# EAGLE design TribeBot21 (EAGLE 6.6.0)
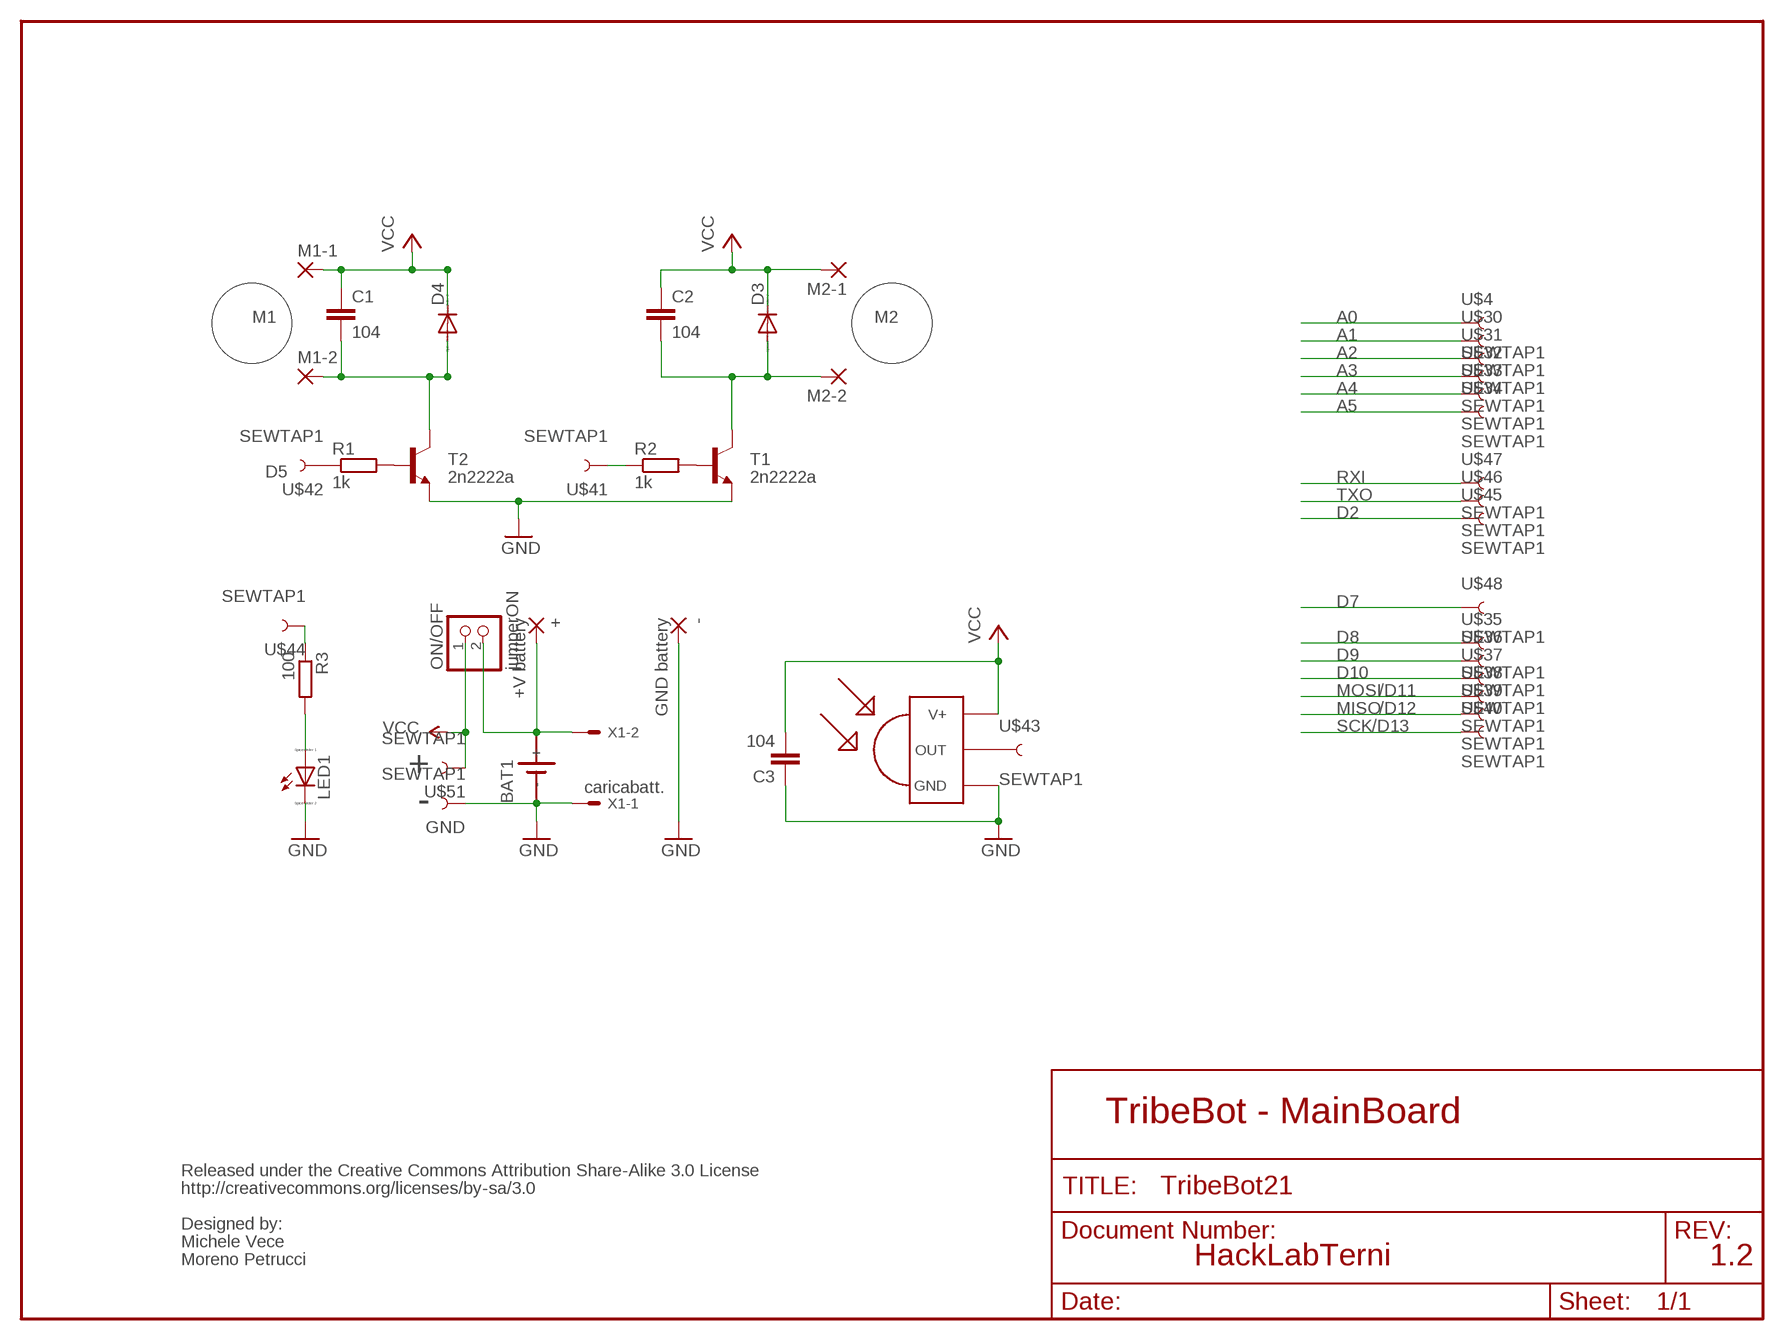
[diagram p0: schematic, sheet 1]

## Parts
+  +V battery  2,15/1,0  [2,15/1,0]
-  GND battery  2,15/1,0  [2,15/1,0]
BAT1  SN2032  [SN2032]
C1  104  C2.5/2  [C2.5-2]
C2  104  C2.5/2  [C2.5-2]
C3  104  C2.5/2  [C2.5-2]
D3  1N4148DO35-7  [DO35-7]
D4  1N4148DO35-7  [DO35-7]
GND  SEWTAP1  [PETAL-LONG-1]
LED1  LED_ELD260  [LED_LD260]
M1-1  1,6/0,8  [1,6/0,8]
M1-2  1,6/0,8  [1,6/0,8]
M2-1  1,6/0,8  [1,6/0,8]
M2-2  1,6/0,8  [1,6/0,8]
ON/OFF  jumperON  PINHD-1X2  [1X02]
R1  1k  R-EU_0204/7  [0204/7]
R2  1k  R-EU_0204/7  [0204/7]
R3  100  R-EU_0204/7  [0204/7]
T1  2n2222a  TRANSISTOR_NPNTO92  [TO-92]
T2  2n2222a  TRANSISTOR_NPNTO92  [TO-92]
U$1  TSOP4838  [TSOP18XX]
U$4  SEWTAP1  [PETAL-LONG-1]
U$30  SEWTAP1  [PETAL-LONG-1]
U$31  SEWTAP1  [PETAL-LONG-1]
U$32  SEWTAP1  [PETAL-LONG-1]
U$33  SEWTAP1  [PETAL-LONG-1]
U$34  SEWTAP1  [PETAL-LONG-1]
U$35  SEWTAP1  [PETAL-LONG-1]
U$36  SEWTAP1  [PETAL-LONG-1]
U$37  SEWTAP1  [PETAL-LONG-1]
U$38  SEWTAP1  [PETAL-LONG-1]
U$39  SEWTAP1  [PETAL-LONG-1]
U$40  SEWTAP1  [PETAL-LONG-1]
U$41  SEWTAP1  [PETAL-LONG-1]
U$42  SEWTAP1  [PETAL-LONG-1]
U$43  SEWTAP1  [PETAL-LONG-1]
U$44  SEWTAP1  [PETAL-LONG-1]
U$45  SEWTAP1  [PETAL-LONG-1]
U$46  SEWTAP1  [PETAL-LONG-1]
U$47  SEWTAP1  [PETAL-LONG-1]
U$48  SEWTAP1  [PETAL-LONG-1]
U$51  SEWTAP1  [PETAL-LONG-1]
X1  caricabatt.  22-23-2021  [22-23-2021]

## Nets
A0: U$4.1
A1: U$30.1
A2: U$31.1
A3: U$32.1
A4: U$33.1
A5: U$34.1
D2: U$45.1
D7: U$48.1
D8: U$35.1
D9: U$36.1
D10: U$37.1
GND [VCC]: -.1(P) BAT1.- C3.1 GND.1 LED1.K(C) T1.1(E) T2.1(E) U$1.GND X1.1
MISO: U$39.1
MOSI: U$38.1
N$1: R1.2 T2.2(B)
N$2: R2.2 T1.2(B)
N$3: R1.1 U$42.1
N$4: R2.1 U$41.1
N$5: LED1.A R3.2
N$6: +.1(P) BAT1.+ ON/OFF.2 X1.2
N$7: U$1.OUT U$43.1
N$8: C1.2 D4.A M1-2.1(P) T2.3(C)
N$9: R3.1 U$44.1
N$12: C2.2 D3.A M2-2.1(P) T1.3(C)
RXI: U$47.1
SCK: U$40.1
TXO: U$46.1
VCC [VCC]: C1.1 C2.1 C3.2 D3.C D4.C M1-1.1(P) M2-1.1(P) ON/OFF.1 U$1.VCC(V+) U$51.1

## Notes on the sheet
- M1 | M2
- D5
- /D11
- /D12
- /D13
- +
- -
- TribeBot - MainBoard
- Released under the Creative Commons Attribution Share-Alike 3.0 License
- http://creativecommons.org/licenses/by-sa/3.0
- Designed by:
- Michele Vece
- Moreno Petrucci | HackLabTerni | 1.2

## Library data of the parts
+ - = wirepad:2,15/1,0: THROUGH-HOLE PAD
BAT1 = sn2032:SN2032: LI BATTERY
C1-C3 = capacitor-wima:C: CAPACITOR naming: grid - package width
D3 D4 = diode:1N4148: DIODE high speed (Philips)
GND U$4 U$30-U$48 U$51 = LilyPad-Wearables:SEWTAP: Sew Taps for LilyPad Boards.
LED1 = eagle-ltspice:LED_E: LED Source: http://www.osram.convergy.de Source: www.luxeon.com Source: www.kingbright.com; SPICEMODEL: NONE; SPICEPREFIX: D; SPICETYPE: diode
M1-1 M1-2 M2-1 M2-2 = wirepad:1,6/0,8: THROUGH-HOLE PAD
ON/OFF = pinhead:PINHD-1X2: PIN HEADER
R1-R3 = resistor:R-EU_: RESISTOR, European symbol
T1 T2 = SparkFun-DiscreteSemi:TRANSISTOR_NPN: Generic NPN BJT MMBT2222A - TRANS-08049 (SOT-23, 1A 40V) MPSA42 - TRANS-09116 (SOT-23, 500mA 300V) MMBT5088LT1G - TRANS-11160 (SOT-23, 50 mA 30V) BC547 - COM-08928 <http://www.sparkfun.com/products/8928> (TO-92 45V 100mA) (1.Collector 2.Base 3.Emitter) 2N3904 - COM-00521 <http://www.sparkfun.com/products/521> (TO-92 40V 200mA) (1.Emitter 2.Base 3.Collector) P2N2222A - COM-12852 <http://www.sparkfun.com/products/12852> (TO-92 40V 600mA) (1.Collector 2.Base 3.Emitter)
U$1 = tsop:TSOP4838: IR Receiver and Demodulator
X1 = con-molex:22-23-2021: .100" (2.54mm) Center Header - 2 Pin; MF: MOLEX; MPN: 22-23-2021; OC_FARNELL: 1462926; OC_NEWARK: 25C3832

## Net classes
1 VCC: width 0.305 mm

## Board
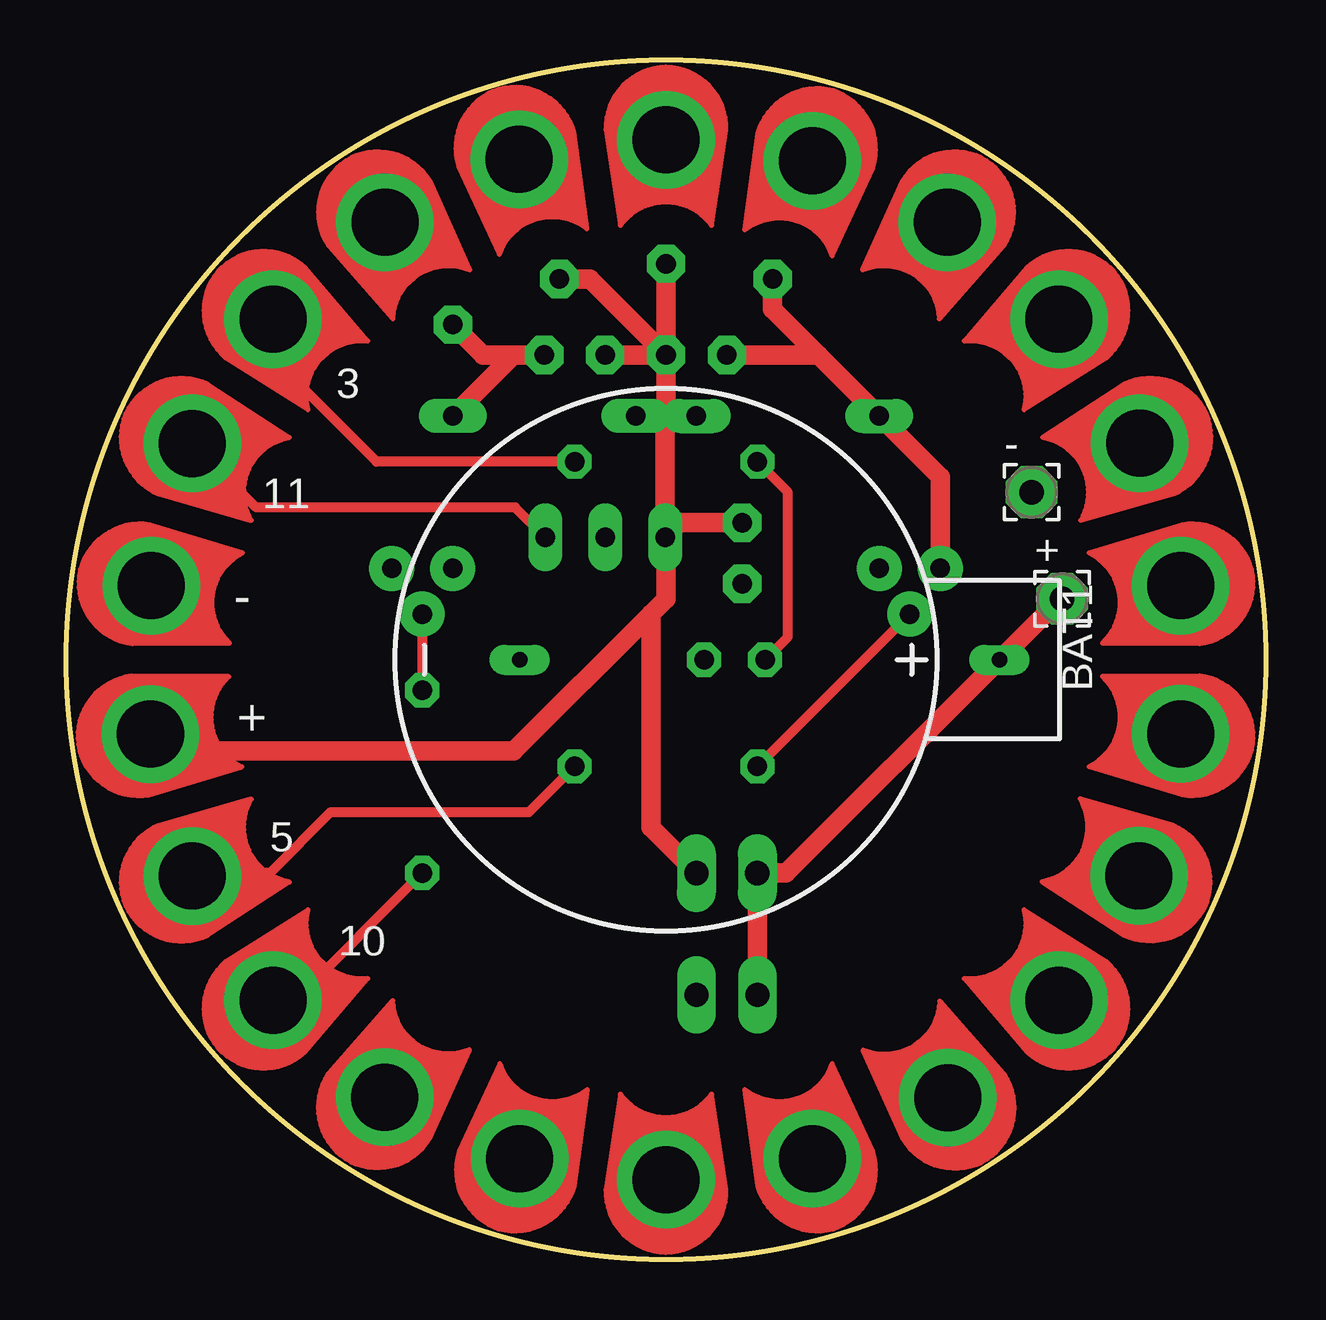
[diagram p1: board, top side]
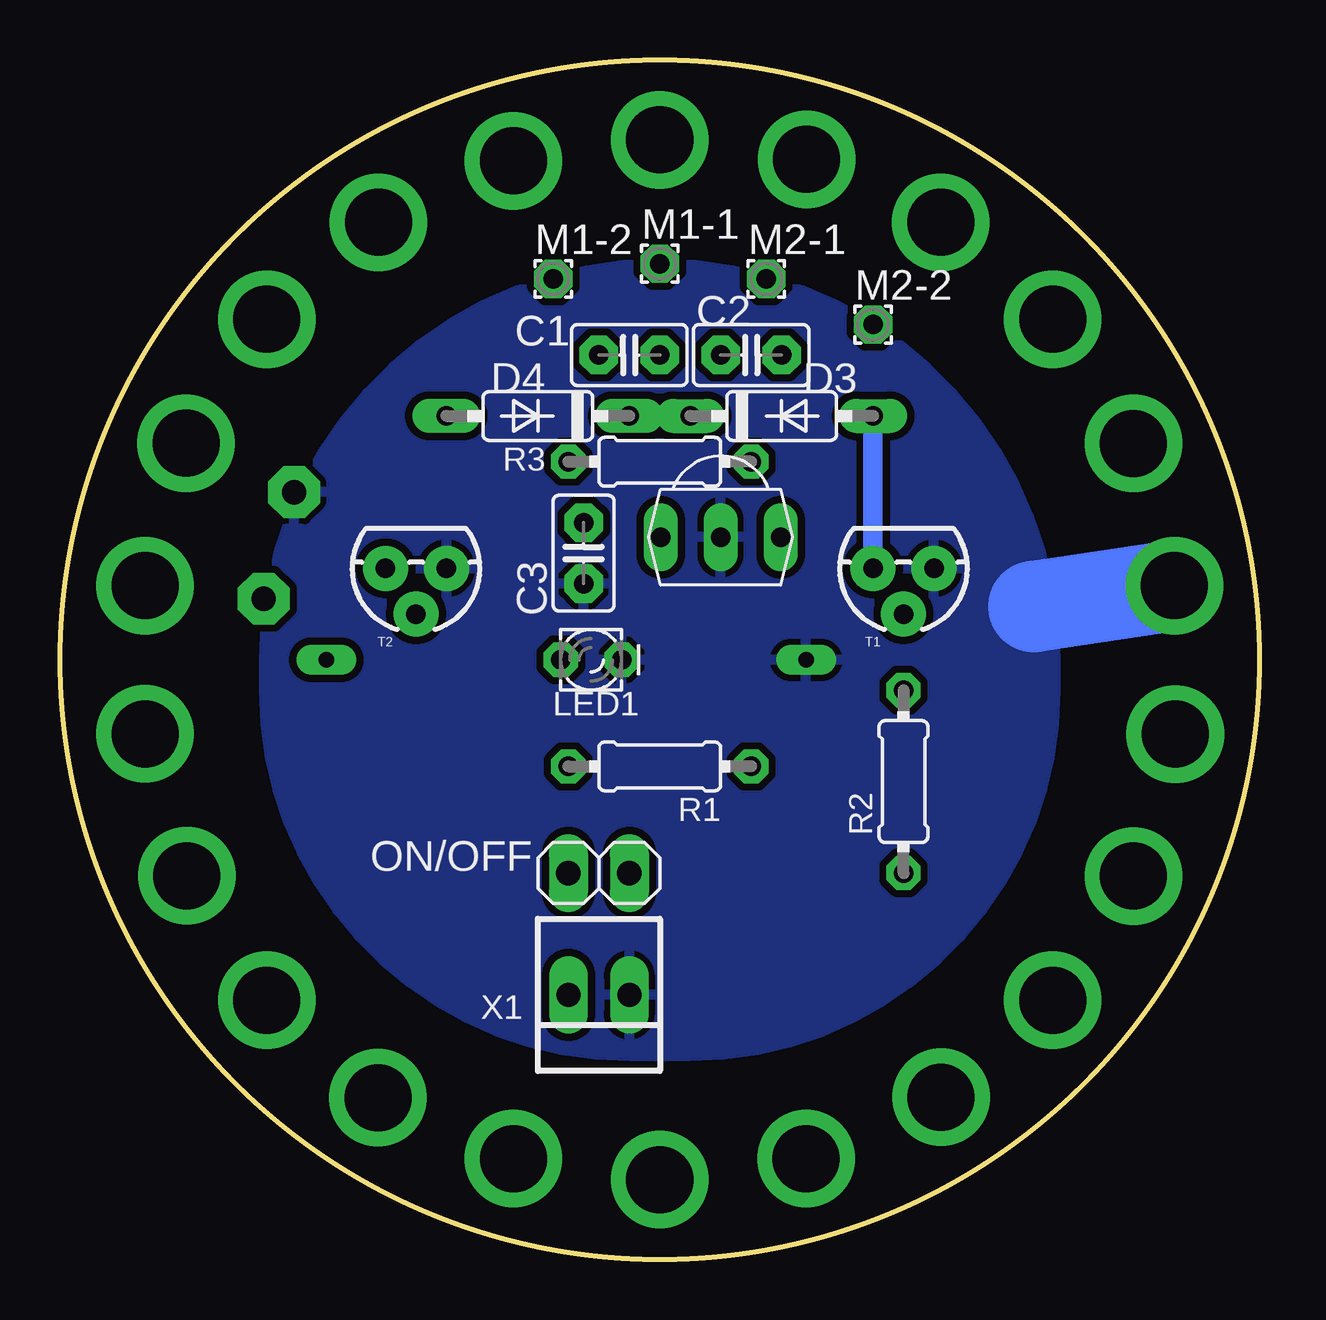
[diagram p2: board, bottom side, seen from below]

Size 50 x 50 mm. Coordinates in mm from the lower left corner, seen from the top.
Outline: circle at 25,25 radius 25
Copper layers (1*16): Top 0.035mm / dielectric 1.5mm / Bottom 0.035mm
Design rules "SparkFun *": minimum track width 8mil, minimum drill 20mil, track to track 12mil, track to pad 12mil, pad to pad 12mil, via to via 12mil, smd to smd 8mil, copper to edge 10mil, drill to drill 8mil, minimum pad ring 12mil, minimum via ring 10mil, stop-mask expansion 4mil, vias tented up to drill 20mil, thermal gap 10mil

### Footprints (pad centres in the part's own frame; a part is rotated, then mirrored left to right if it is on the bottom)
2,15/1,0 = drill 1.016 pad 2.159 octagon: 1 0,0
SN2032 = drill 0.65 long: + 0,13.9; - 0,-6.1
C2.5-2 = drill 0.813 pad 1.6 octagon: 1 -1.27,0; 2 1.27,0
DO35-7 = drill 0.813 long: A 3.81,0; C -3.81,0
PETAL-LONG-1 = drill 2.794 pad 4.064: 1 0.03,0
LED_LD260 = drill 0.813 octagon: A -1.27,0; K 1.27,0
1,6/0,8 = drill 0.813 pad 1.6 octagon: 1 0,0
1X02 = drill 1.016 long: 1 -1.27,0; 2 1.27,0
0204/7 = drill 0.813 octagon: 1 -3.81,0; 2 3.81,0
TO-92 = drill 0.813 pad 1.88: 1 -1.27,0; 2 0,1.905; 3 1.27,0
TSOP18XX = drill 0.813 long: GND -0.001,-0.027; OUT -2.501,-0.027; VCC 2.499,-0.027
22-23-2021 = drill 1 long: 1 -1.27,0; 2 1.27,0

### Placement (x,y rotation side)
+  41.51,27.54 0 top
-  40.24,31.98 0 top
BAT1  25,25 270 top
C1  26.27,37.7 180 bottom
C2  21.19,37.7 0 bottom
C3  28.17,29.44 90 bottom
D3  19.92,35.16 0 bottom
D4  30.08,35.16 180 bottom
GND  3.52,28.09 351.8 top
LED1  27.86,25 0 bottom
M1-1  25,41.51 0 bottom
M1-2  29.44,40.88 0 bottom
M2-1  20.55,40.88 0 bottom
M2-2  16.11,38.97 0 bottom
ON/OFF  27.54,16.11 180 bottom
R1  25,20.55 180 bottom
R2  14.84,19.92 90 bottom
R3  25,33.25 180 bottom
T1  14.84,28.81 180 bottom
T2  35.16,28.81 180 bottom
U$1  22.46,30.08 180 bottom
U$4  46.48,21.91 171.8 top
U$30  46.48,28.09 188.2 top
U$31  44.77,34.04 204.5 top
U$32  41.4,39.21 220.9 top
U$33  36.74,43.26 237.3 top
U$34  31.11,45.83 253.7 top
U$35  18.89,4.17 73.7 top
U$36  25,3.3 90 top
U$37  31.11,4.17 106.3 top
U$38  36.76,6.72 122.7 top
U$39  41.4,10.79 139.1 top
U$40  44.74,15.98 155.5 top
U$41  8.6,10.79 40.9 top
U$42  5.23,15.97 24.5 top
U$43  5.23,34.03 335.5 top
U$44  8.6,39.21 319.1 top
U$45  13.27,43.26 302.7 top
U$46  18.87,45.89 286.3 top
U$47  25,46.7 270 top
U$48  13.26,6.74 57.3 top
U$51  3.48,21.9 8.2 top
X1  27.54,11.03 180 bottom

### Tracks (layer width: path | path; a pad name or v marks a point on that pad's centre or on a via)
GND
  Bottom 3.81: GND.1 9.4,27.21
  pour Bottom: 8.49,23.73 8.49,25 arc-90 25,41.51 arc-90 41.51,25 41.51,23.73 arc-90 26.27,8.49 23.73,8.49 arc-90
N$1
  Top 0.406: R1.2 T2.2
N$2
  Top 0.406: T1.2 R2.2
N$3
  Top 0.406: R1.1 19.28,18.65 11.03,18.65 8.49,16.11 5.38,16.11 U$42.1
N$4
  Top 0.406: R2.1 9.54,10.81 U$41.1
N$5
  Top 0.406: R3.2 30.08,31.98 30.08,25.95 LED1.A
N$6
  Top 0.813: BAT1.+ 38.97,24.93 | +.1 41.44,27.54 BAT1.+ | BAT1.+ 30.01,16.11 ON/OFF.2 X1.2
N$7
  Top 0.406: U$1.OUT 18.71,31.35 7.92,31.35 U$43.1 8.36,34.02
N$8
  Top 0.813: T2.3 36.43,32.62 D4.A 31.35,37.7 | 31.35,37.7 C1.2 | M1-2.1 29.44,39.6 31.35,37.7
N$9
  Top 0.406: R3.1 12.93,33.25 9.12,37.06 8.49,39.06 U$44.1
N$12
  Top 0.813: C2.2 18.65,37.7 | 18.65,37.7 D3.A | 18.65,37.7 17.38,37.7 M2-2.1
  Bottom 0.813: D3.A T1.3
VCC
  Top 0.813: D4.C 25,35.16 | 25,35.16 D3.C | U$51.1 3.59,21.82 | U$1.VCC 25,30.06 25,27.54 24.36,26.9 | 24.36,26.9 18.65,21.19 5.95,21.19 5.24,21.9 U$51.1 | 4.06,22.46 U$51.1 | C3.2 25.57,30.71 U$1.VCC | U$1.VCC 24.96,35.12 25,35.16 | 25,35.16 C1.1 | ON/OFF.1 24.36,18.01 24.36,26.9 | C1.1 M1-1.1 | C2.1 C1.1 | M2-1.1 21.82,40.88 C1.1

### Text on the board
tPlace: 3 | 11 | - | + | 5 | 10